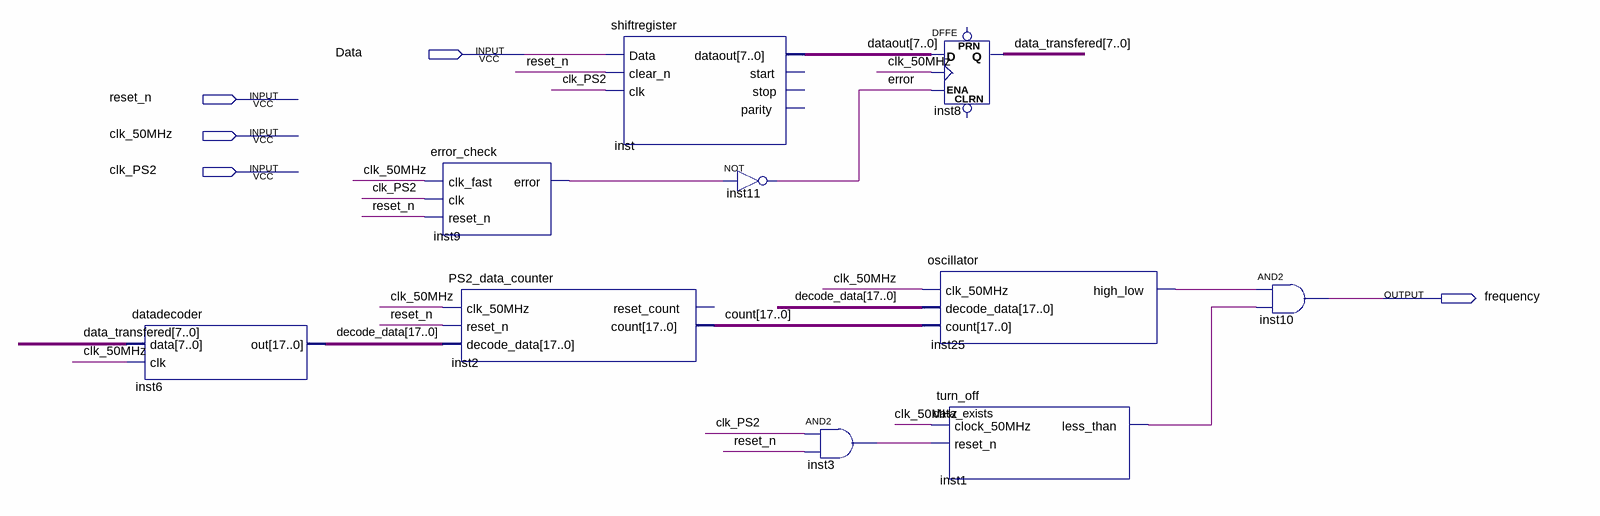
[diagram p0: schematic sheet]
// Quartus schematic FinalProject.bdf as structural Verilog: 10 symbols, 5 pins
module FinalProject (
  input  Data,
  input  reset_n,
  input  clk_50MHz,
  input  clk_PS2,
  output frequency
);

  wire data_exists, error, inst3_out, inst9_error, inst25_high_low;
  wire [7:0] data_transfered, dataout;
  wire [17:0] count, decode_data;

  datadecoder inst6 (.data(data_transfered), .clk(clk_50MHz), .out(decode_data));
  error_check inst9 (.clk_fast(clk_50MHz), .clk(clk_PS2), .reset_n(reset_n), .error(inst9_error));
  PS2_data_counter inst2 (
    .clk_50MHz(clk_50MHz), .reset_n(reset_n), .decode_data(decode_data), .count(count));  // open: reset_count
  shiftregister inst (.Data(Data), .clear_n(reset_n), .clk(clk_PS2), .dataout(dataout));  // open: start, stop, parity
  not inst11 (error, inst9_error);
  and inst3 (inst3_out, clk_PS2, reset_n);
  DFFE inst8[7:0] (.D(dataout), .CLK(clk_50MHz), .ENA(error), .Q(data_transfered));  // open: PRN, CLRN
  oscillator inst25 (.clk_50MHz(clk_50MHz), .decode_data(decode_data), .count(count), .high_low(inst25_high_low));
  turn_off inst1 (.clock_50MHz(clk_50MHz), .reset_n(inst3_out), .less_than(data_exists));
  and inst10 (frequency, inst25_high_low, data_exists);
endmodule
